# Altium schematic sheet PLL.SchDoc
size A4
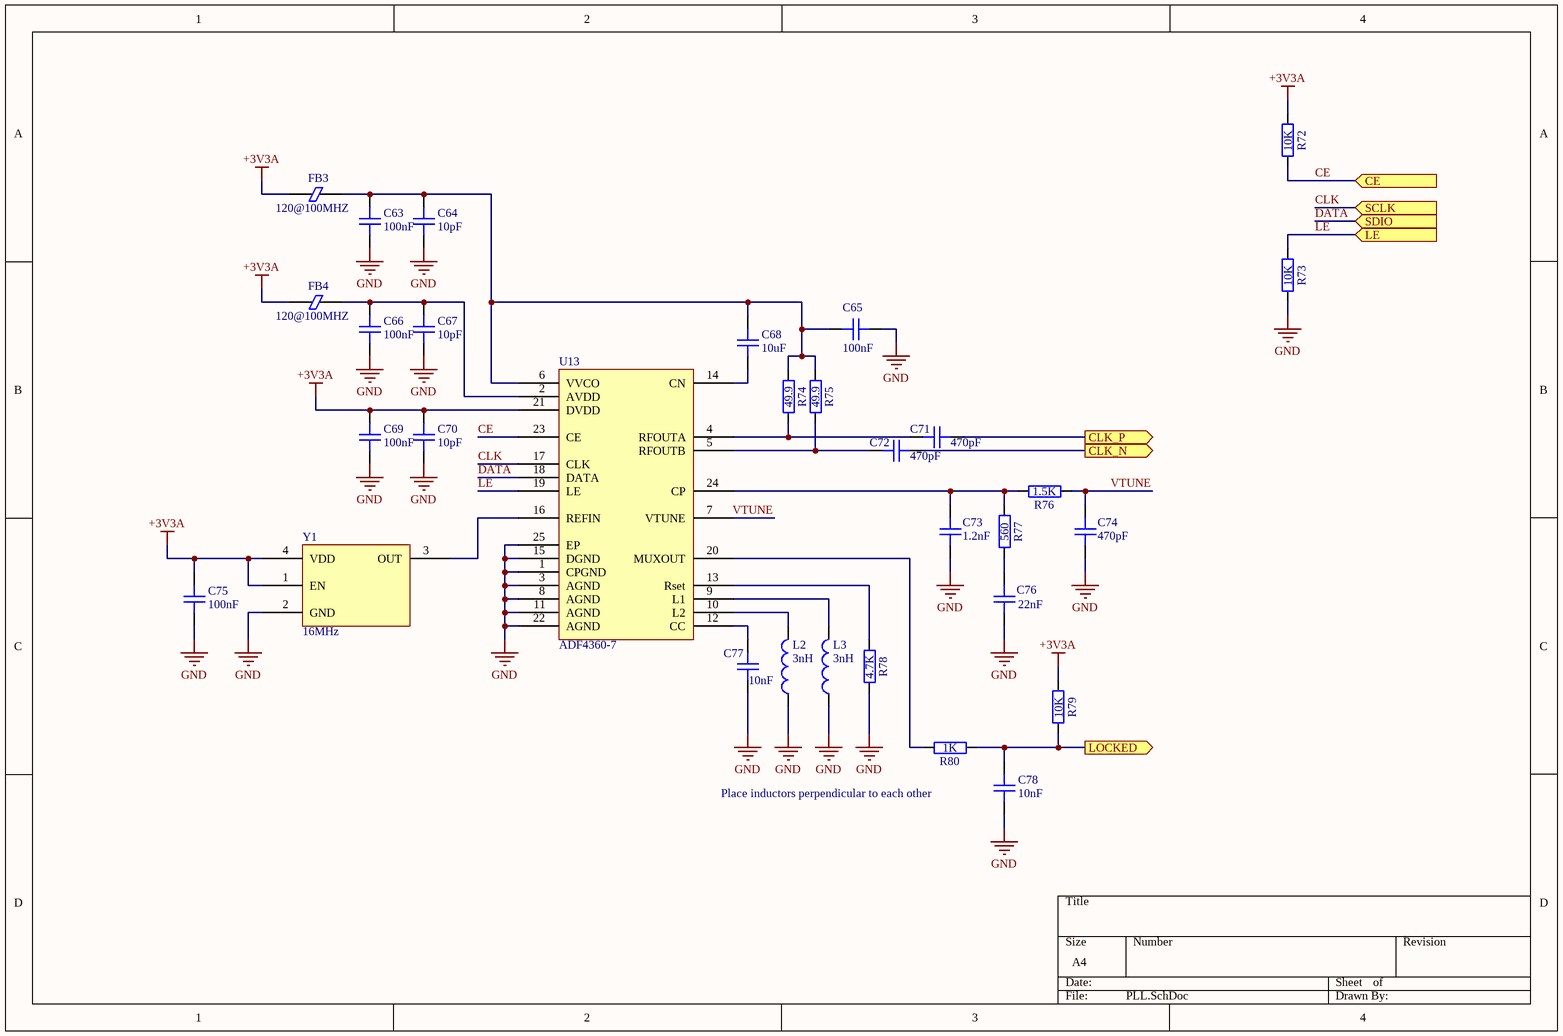
[diagram p0: PLL.SchDoc]

## Parts
C63  100nF  [GEN_C_0402]
C64  10pF  [GEN_C_0402]
C65  100nF  [GEN_C_0402]
C66  100nF  [GEN_C_0402]
C67  10pF  [GEN_C_0402]
C68  10uF  [GEN_C_0603]
C69  100nF  [GEN_C_0402]
C70  10pF  [GEN_C_0402]
C71  470pF  [GEN_C_0402]
C72  470pF  [GEN_C_0402]
C73  1.2nF  [GEN_C_0603]
C74  470pF  [GEN_C_0402]
C75  100nF  [GEN_C_0402]
C76  22nF  [GEN_C_0603]
C77  10nF  [GEN_C_0402]
C78  10nF  [GEN_C_0402]
FB3  120@100MHZ  [GEN_R_0402]
FB4  120@100MHZ  [GEN_R_0402]
L2  3nH  [GEN_L_0402]
L3  3nH  [GEN_L_0402]
R72  10K  [GEN_R_0402]
R73  10K  [GEN_R_0402]
R74  49.9  [GEN_R_0402]
R75  49.9  [GEN_R_0402]
R76  1.5K  [GEN_R_0402]
R77  560  [GEN_R_0402]
R78  4.7K  [GEN_R_0402]
R79  10K  [GEN_R_0402]
R80  1K  [GEN_R_0402]
U13  ADF4360-7  [AD_QFN24_CP-24-14]
Y1  16MHz  [ECS_TXO-2016]

## Ports
CE (in), CLK_N (out), CLK_P (out), LE (in), LOCKED (out), SCLK (in), SDIO (in)

## Nets
+3V3A: C69.2 C70.2 C75.1 FB3.1 FB4.1 R72.1 R79.1 U13.21(DVDD) Y1.1(EN) Y1.4(VDD)
GND: C63.1 C64.1 C65.1 C66.1 C67.1 C69.1 C70.1 C73.1 C74.1 C75.2 C76.1 C77.1 C78.1 L2.1 L3.1 R73.2 R78.1 U13.1(CPGND) U13.3(AGND) U13.8(AGND) U13.11(AGND) U13.15(DGND) U13.22(AGND) U13.25(EP) Y1.2(GND)
CE: R72.2 U13.23(CE) ; port CE
CLK: U13.17(CLK) ; port SCLK
CLK_N: C72.1 ; port CLK_N
CLK_P: C71.1 ; port CLK_P
DATA: U13.18(DATA) ; port SDIO
LE: R73.1 U13.19(LE) ; port LE
LOCKED: C78.2 R79.2 R80.2 ; port LOCKED
VTUNE: C74.2 R76.2 U13.7(VTUNE)
NetC63_2: C63.2 C64.2 C65.2 C68.2 FB3.2 R74.2 R75.2 U13.6(VVCO)
NetC66_2: C66.2 C67.2 FB4.2 U13.2(AVDD)
NetC68_1: C68.1 U13.14(CN)
NetC71_2: C71.2 R74.1 U13.4(RFOUTA)
NetC72_2: C72.2 R75.1 U13.5(RFOUTB)
NetC73_2: C73.2 R76.1 R77.2 U13.24(CP)
NetC76_2: C76.2 R77.1
NetC77_2: C77.2 U13.12(CC)
NetL2_2: L2.2 U13.10(L2)
NetL3_2: L3.2 U13.9(L1)
NetR78_2: R78.2 U13.13(Rset)
NetR80_1: R80.1 U13.20(MUXOUT)
NetU13_16: U13.16(REFIN) Y1.3(OUT)

## Notes on the sheet
- (near C78) Place inductors perpendicular to each other

## Library data of the parts
C63 C65 C66 C69 C75 = CAP 100nF 16V X7R 0402: Voltage Rating: 16V; Package: 0402; Supplier 1: Digi-Key; Supplier Part Number 1: 490-4759-1-ND; Value: 100nF
C64 C67 C70 = CAP 10pF 50V C0G 0402: Temperature Coefficient: C0G; Voltage Rating: 50V; Package: 0402; Value: 10pF; Supplier 1: Digi-Key; Supplier Part Number 1: 1276-1139-1-ND
C68 = CAP 10uF 10V X5R 0603: Voltage Rating: 10V; Package: 0402; Supplier 1: Digi-Key; Supplier Part Number 1: 490-10474-1-ND; Value: 10uF
C71 C72 = CAP 470pF 50V C0G 0402: Voltage Rating: 50V; Temperature Coefficient: C0G; Package: 0402; Supplier 1: Digi-Key; Supplier Part Number 1: 490-8207-1-ND; Value: 470pF
C73 = CAP 1.2nF 50V C0G 0603: Voltage Rating: 50V; Temperature Coefficient: C0G; Package: 0603; Value: 1.2nF; Supplier 1: Digi-Key; Supplier Part Number 1: 490-1453-1-ND
C74 = CAP 470pF 50V C0G 0402: Temperature Coefficient: C0G; Voltage Rating: 50V; Package: 0402; Supplier 1: Digi-Key; Supplier Part Number 1: 490-8207-1-ND; Value: 470pF
C76 = CAP 22nF 100V X7R 0603: Voltage Rating: 100V; Supplier 1: Digi-Key; Supplier Part Number 1: 490-4782-1-ND; Package: 0603; Value: 22nF
C77 C78 = CAP 10nF 50V X7R 0402: Voltage Rating: 50V; Package: 0402; Supplier 1: Digi-Key; Supplier Part Number 1: 490-4762-1-ND; Value: 10nF
FB3 FB4 = FERRITE BEAD 120 OHM 0402: Supplier 1: Digi-Key; Supplier Part Number 1: 490-9656-1-ND
L2 L3 = IND 3nH +/-0.05nH 0402: Value: 3nH; Supplier 1: Digi-Key; Supplier Part Number 1: 490-8434-1-ND
R72 R73 R79 = RES 10K OHM 1% 1/10W 0402: Tolerance: 1%; Power Rating: 0.1W; Package: 0402; Supplier 1: Digi-Key; Supplier Part Number 1: P10.0KLCT-ND; Value: 10K
R74 R75 = RES 49.9 OHM 1% 1/10W 0402: Tolerance: 1%; Power Rating: 0.1W; Package: 0402; Supplier 1: Digi-Key; Supplier Part Number 1: P49.9LCT-ND; Value: 49.9
R76 = RES 1.5K OHM 1% 1/16W 0402: Tolerance: 1%; Power Rating: 0.0625W; Package: 0402; Value: 1.5K; Supplier 1: Digi-Key; Supplier Part Number 1: 311-1.50KLRCT-ND
R77 = RES 560 OHM 1% 1/16W 0402: Tolerance: 1%; Power Rating: 0.0625W; Package: 0402; Value: 560; Supplier 1: Digi-Key; Supplier Part Number 1: 311-560LRCT-ND
R78 = RES 4.7K OHM 1% 1/10W 0402: Tolerance: 1%; Power Rating: 0.1W; Package: 0402; Supplier 1: Digi-Key; Supplier Part Number 1: P4.70KLCT-ND; Value: 4.7K
R80 = RES 1K OHM 1% 1/10W 0402: Tolerance: 1%; Power Rating: 0.1W; Package: 0402; Supplier 1: Digi-Key; Supplier Part Number 1: P1.00KLCT-ND; Value: 1K
U13 = IC PLL ADF4360-7: Supplier 1: Digi-Key; Supplier Part Number 1: ADF4360-7BCPZRL7CT-ND
Y1 = OSC 16MHz ECS-TXO-2016: Supplier 1: Digi-Key; Supplier Part Number 1: XC3161CT-ND